# EAGLE design STM32L441CE_2L (EAGLE 9.6.2)

## Sheet 1 of 2
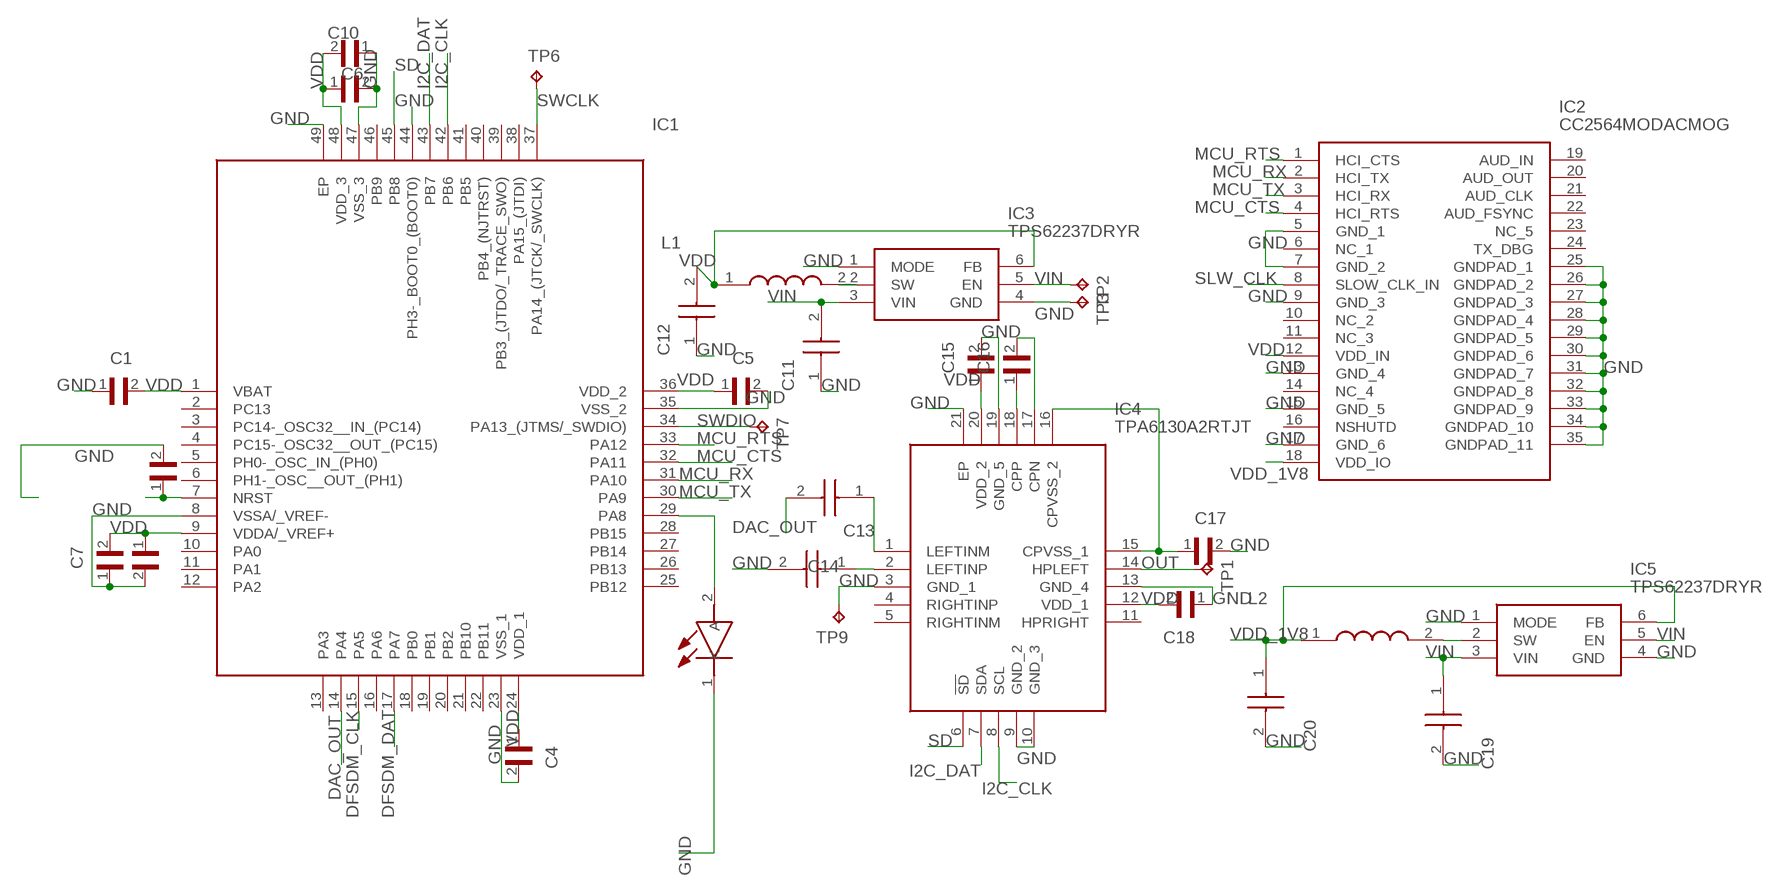
[diagram p0: schematic, sheet 1]

### Parts
C1  GRM033C80J104KE15D  [CAPC0603X33N]
C2  GRM033C80J104KE15D  [CAPC0603X33N]
C3  GRM033C80J104KE15D  [CAPC0603X33N]
C4  GRM033C80J104KE15D  [CAPC0603X33N]
C5  GRM033C80J104KE15D  [CAPC0603X33N]
C6  GRM033C80J104KE15D  [CAPC0603X33N]
C7  JMK105C6105KV-F  [CAPC1005X55N]
C10  GRM155R60J475ME47D  [CAPC1005X60N]
C11  02016D225MAT2A  [CAPC0603X33N]
C12  GRM035R60J475ME15D  [CAPC0603X55N]
C13  CL03A474KQ3NNNC  [CAPC0603X33N]
C14  CL03A474KQ3NNNC  [CAPC0603X33N]
C15  JMK105C6105KV-F  [CAPC1005X55N]
C16  JMK105C6105KV-F  [CAPC1005X55N]
C17  JMK105C6105KV-F  [CAPC1005X55N]
C18  JMK105C6105KV-F  [CAPC1005X55N]
C19  02016D225MAT2A  [CAPC0603X33N]
C20  GRM035R60J475ME15D  [CAPC0603X55N]
IC1  STM32L451CEU6  [QFN50P700X700X60-49N]
IC2  CC2564MODACMOG  [MOG0035A]
IC3  TPS62237DRYR  [SON50P100X145X60-6N]
IC4  TPA6130A2RTJT  [QFN50P400X400X80-21N]
IC5  TPS62237DRYR  [SON50P100X145X60-6N]
L1  MLZ1005M2R2WT000  [INDC1005X55N]
L2  MLZ1005M2R2WT000  [INDC1005X55N]
LED1  VLMS1500-GS08  [VLMG1500GS08]
TP1  TPTP11R  [TP11R]
TP2  TPTP11R  [TP11R]
TP3  TPTP11R  [TP11R]
TP6  TPTP11R  [TP11R]
TP7  TPTP11R  [TP11R]
TP9  TPTP11R  [TP11R]

### Nets
DAC_OUT: C13.2 IC1.14(PA4)
DFSDM_CLK: IC1.15(PA5) ; also sheet 2
DFSDM_DAT: IC1.17(PA7) ; also sheet 2
GND: C1.1 C2.2 C3.2 C4.2 C5.2 C6.2 C7.1 C10.1 C11.1 C12.1 C14.2 C15.2 C17.2 C18.1 C19.2 C20.2 IC1.8(VSSA/_VREF-) IC1.23(VSS_1) IC1.35(VSS_2) IC1.44(PH3-_BOOT0_(BOOT0)) IC1.47(VSS_3) IC1.49(EP) IC2.5(GND_1) IC2.7(GND_2) IC2.9(GND_3) IC2.13(GND_4) IC2.15(GND_5) IC2.17(GND_6) IC2.25(GNDPAD_1) IC2.26(GNDPAD_2) IC2.27(GNDPAD_3) IC2.28(GNDPAD_4) IC2.29(GNDPAD_5) IC2.30(GNDPAD_6) IC2.31(GNDPAD_7) IC2.32(GNDPAD_8) IC2.33(GNDPAD_9) IC2.34(GNDPAD_10) IC2.35(GNDPAD_11) IC3.1(MODE) IC3.4(GND) IC4.3(GND_1) IC4.9(GND_2) IC4.10(GND_3) IC4.13(GND_4) IC4.19(GND_5) IC4.21(EP) IC5.1(MODE) IC5.4(GND) LED1.1(K) TP3.TP TP9.TP ; also sheet 2
I2C_CLK: IC1.42(PB6) IC4.8(SCL)
I2C_DAT: IC1.43(PB7) IC4.7(SDA)
MCU_CTS: IC1.32(PA11) IC2.4(HCI_RTS)
MCU_RTS: IC1.33(PA12) IC2.1(HCI_CTS)
MCU_RX: IC1.31(PA10) IC2.2(HCI_TX)
MCU_TX: IC1.30(PA9) IC2.3(HCI_RX)
N$1: C2.1 IC1.7(NRST)
N$2: IC3.2(SW) L1.2
N$3: C13.1 IC4.1(LEFTINM)
N$4: C14.1 IC4.2(LEFTINP)
N$5: IC1.29(PA8) LED1.2(A)
N$6: C16.1 IC4.18(CPP)
N$7: C16.2 IC4.17(CPN)
N$8: C17.1 IC4.15(CPVSS_1) IC4.16(CPVSS_2)
N$9: IC5.2(SW) L2.2
OUT: IC4.14(HPLEFT) TP1.TP
SD: IC1.45(PB8) IC4.6(!SD)
SLW_CLK: IC2.8(SLOW_CLK_IN)
SWCLK: IC1.37(PA14_(JTCK/_SWCLK)) TP6.TP
SWDIO: IC1.34(PA13_(JTMS/_SWDIO)) TP7.TP
VDD: C1.2 C3.1 C4.1 C5.1 C6.1 C7.2 C10.2 C12.2 C15.1 C18.2 IC1.1(VBAT) IC1.9(VDDA/_VREF+) IC1.24(VDD_1) IC1.36(VDD_2) IC1.48(VDD_3) IC2.12(VDD_IN) IC3.6(FB) IC4.12(VDD_1) IC4.20(VDD_2) L1.1 ; also sheet 2
VDD_1V8: C20.1 IC2.18(VDD_IO) IC5.6(FB) L2.1
VIN: C11.2 C19.1 IC3.3(VIN) IC3.5(EN) IC5.3(VIN) IC5.5(EN) TP2.TP
Unconnected: IC1.2(PC13) IC1.3(PC14-_OSC32__IN_(PC14)) IC1.4(PC15-_OSC32__OUT_(PC15)) IC1.5(PH0-_OSC_IN_(PH0)) IC1.6(PH1-_OSC__OUT_(PH1)) IC1.10(PA0) IC1.11(PA1) IC1.12(PA2) IC1.13(PA3) IC1.16(PA6) IC1.18(PB0) IC1.19(PB1) IC1.20(PB2) IC1.21(PB10) IC1.22(PB11) IC1.25(PB12) IC1.26(PB13) IC1.27(PB14) IC1.28(PB15) IC1.38(PA15_(JTDI)) IC1.39(PB3_(JTDO/_TRACE_SWO)) IC1.40(PB4_(NJTRST)) IC1.41(PB5) IC1.46(PB9) IC2.6(NC_1) IC2.10(NC_2) IC2.11(NC_3) IC2.14(NC_4) IC2.16(NSHUTD) IC2.19(AUD_IN) IC2.20(AUD_OUT) IC2.21(AUD_CLK) IC2.22(AUD_FSYNC) IC2.23(NC_5) IC2.24(TX_DBG) IC4.4(RIGHTINP) IC4.5(RIGHTINM) IC4.11(HPRIGHT)

## Sheet 2 of 2
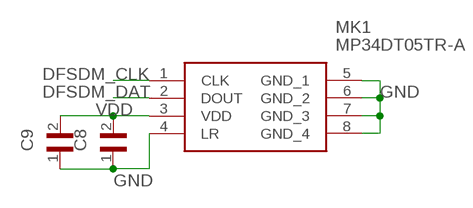
[diagram p1: schematic, sheet 2]

### Parts
C8  JMK105C6105KV-F  [CAPC1005X55N]
C9  GRM033C80J104KE15D  [CAPC0603X33N]
MK1  MP34DT05TR-A  [MP34DT05TRA]

### Nets
DFSDM_CLK: MK1.1(CLK) ; also sheet 1
DFSDM_DAT: MK1.2(DOUT) ; also sheet 1
GND: C8.1 C9.1 MK1.4(LR) MK1.5(GND_1) MK1.6(GND_2) MK1.7(GND_3) MK1.8(GND_4) ; also sheet 1
VDD: C8.2 C9.2 MK1.3(VDD) ; also sheet 1

## Library data of the parts
C1-C6 C9 = GRM033C80J104KE15D:GRM033C80J104KE15D: .1UF 6.3V 10% 0201; DESCRIPTION: SMD Capacitor X6S(EIA) with Capacitance: 0.10uF Tol. 10%. Rated Voltage: 6.3Vdc; DIGI-KEY_PART_NUMBER: 490-10390-1-ND; DIGIKEY-PURCHASE-URL: https://snapeda.com/shop?store=DigiKey&id=1836969; MF: Murata Electronics; MP: GRM033C80J104KE15D; PACKAGE: 0603 Taiyo Yuden
C7 C8 C15-C18 = JMK105C6105KV-F:JMK105C6105KV-F: CAP CER 1UF 6.3V X6S 0402; DESCRIPTION: 1µF ±10% 6.3V Ceramic Capacitor X6S 0402 (1005 Metric); DIGI-KEY_PART_NUMBER: 587-3381-1-ND; MF: Taiyo Yuden; MP: JMK105C6105KV-F; PACKAGE: 1005 Taiyo Yuden
C10 = GRM155R60J475ME47D:GRM155R60J475ME47D: Cap Ceramic 4.7uF 6.3V X5R 20% Pad SMD 0402 85°C T/R; DESCRIPTION: SMD Capacitor X5R(EIA) with Capacitance: 4.7uF Tol. 20%. Rated Voltage: 6.3Vdc; DIGI-KEY_PART_NUMBER: 490-5915-1-ND; MF: Murata; MP: GRM155R60J475ME47D; PACKAGE: 1005 Taiyo Yuden
C11 C19 = 02016D225MAT2A:02016D225MAT2A: Multilayer Ceramic Capacitors MLCC - SMD/SMT 6.3V 2.2uF X5R 0201 20% Tol Source: Datasheet <http://www.mouser.com/catalog/supplier/library/pdf/AVXSurfaceMountCeramic.pdf>; ARROW_PART_NUMBER: 02016D225MAT2A; ARROW_PRICE-STOCK: https://www.arrow.com/en/products/02016d225mat2a/avx; DESCRIPTION: Multilayer Ceramic Capacitors MLCC - SMD/SMT 6.3V 2.2uF X5R 0201 20% Tol; HEIGHT: 0.33mm; MANUFACTURER_NAME: AVX; MANUFACTURER_PART_NUMBER: 02016D225MAT2A; MOUSER_PART_NUMBER: 581-02016D225MAT2A; MOUSER_PRICE-STOCK: https://www.mouser.co.uk/ProductDetail/AVX/02016D225MAT2A?qs=ZBeOGGPQgEHFnviVlXcPQQ%3D%3D
C12 C20 = GRM035R60J475ME15D:GRM035R60J475ME15D: Multilayer Ceramic Capacitors MLCC - SMD/SMT 0201 4.7uF 6.3volts *Derate Voltage/Temp Source: Datasheet <https://psearch.en.murata.com/capacitor/product/GRM035R60J475ME15#.pdf>; ARROW_PART_NUMBER: GRM035R60J475ME15D; ARROW_PRICE-STOCK: https://www.arrow.com/en/products/grm035r60j475me15d/murata-manufacturing; DESCRIPTION: Multilayer Ceramic Capacitors MLCC - SMD/SMT 0201 4.7uF 6.3volts *Derate Voltage/Temp; HEIGHT: 0.55mm; MANUFACTURER_NAME: Murata Electronics; MANUFACTURER_PART_NUMBER: GRM035R60J475ME15D; MOUSER_PART_NUMBER: 81-GRM035R60J475ME5D; MOUSER_PRICE-STOCK: https://www.mouser.co.uk/ProductDetail/Murata-Electronics/GRM035R60J475ME15D?qs=I53XXhTNm8vhFCgPvCZ%252BPQ%3D%3D
C13 C14 = CL03A474KQ3NNNC:CL03A474KQ3NNNC: CAP CER 0.47UF 6.3V X5R 0201 Source: Datasheet <https://static6.arrow.com/aropdfconversion/f331fa34aa05e23db43dec65c064e91f2185871/19-cl03a474kq3nnnc.pdf>; DESCRIPTION: CAP CER 0.47UF 6.3V X5R 0201; HEIGHT: 0.33mm; MANUFACTURER_NAME: Samsung Electro-Mechanics; MANUFACTURER_PART_NUMBER: CL03A474KQ3NNNC
IC1 = STM32L451CEU6:STM32L451CEU6: MCU 32-bit ARM Cortex M4 RISC 512KB Flash 3.3V 48-Pin UFQFPN Tray Source: Datasheet <https://www.arrow.com/en/products/stm32l451ceu6/stmicroelectronics>; ARROW_PART_NUMBER: STM32L451CEU6; ARROW_PRICE-STOCK: https://www.arrow.com/en/products/stm32l451ceu6/stmicroelectronics; DESCRIPTION: MCU 32-bit ARM Cortex M4 RISC 512KB Flash 3.3V 48-Pin UFQFPN Tray; HEIGHT: 0.6mm; MANUFACTURER_NAME: STMicroelectronics; MANUFACTURER_PART_NUMBER: STM32L451CEU6; MOUSER_PART_NUMBER: 511-STM32L451CEU6; MOUSER_PRICE-STOCK: https://www.mouser.com/Search/Refine.aspx?Keyword=511-STM32L451CEU6
IC2 = CC2564MODACMOG:CC2564MODACMOG: Dual-mode Bluetooth® CC2564 module with integrated antenna Source: Datasheet <http://www.ti.com/lit/ds/symlink/cc2564moda.pdf>; ARROW_PART_NUMBER: CC2564MODACMOG; ARROW_PRICE-STOCK: https://www.arrow.com/en/products/cc2564modacmog/texas-instruments; DESCRIPTION: Dual-mode Bluetooth&#174; CC2564 module with integrated antenna; HEIGHT: mm; MANUFACTURER_NAME: Texas Instruments; MANUFACTURER_PART_NUMBER: CC2564MODACMOG; MOUSER_PART_NUMBER: 595-CC2564MODACMOG; MOUSER_PRICE-STOCK: https://www.mouser.co.uk/ProductDetail/Texas-Instruments/CC2564MODACMOG?qs=tCMd4XlZ%2FiD0qx2OJWZ%2FcQ%3D%3D
IC3 IC5 = TPS62237DRYR:TPS62237DRYR: 2 MHz Ultra Small Step Down Converter with DCS-Control in 1x1.5 SON Package Source: Datasheet <http://www.ti.com/lit/gpn/TPS62230>; ARROW_PART_NUMBER: TPS62237DRYR; ARROW_PRICE-STOCK: https://www.arrow.com/en/products/tps62237dryr/texas-instruments; DESCRIPTION: 2 MHz Ultra Small Step Down Converter with DCS-Control in 1x1.5 SON Package; HEIGHT: 0.6mm; MANUFACTURER_NAME: Texas Instruments; MANUFACTURER_PART_NUMBER: TPS62237DRYR; MOUSER_PART_NUMBER: 595-TPS62237DRYR; MOUSER_PRICE-STOCK: https://www.mouser.co.uk/ProductDetail/Texas-Instruments/TPS62237DRYR?qs=%2Fqzd9s%252BcLd6Amw0z%252Byi3sQ%3D%3D
IC4 = TPA6130A2RTJT:TPA6130A2RTJT: Texas Instruments TPA6130A2RTJT Headphone Audio Amplifier, Class-AB Mono/Stereo 68dB, 20-Pin QFN Source: Datasheet <http://www.ti.com/lit/ds/symlink/tpa6130a2.pdf>; ARROW_PART_NUMBER: TPA6130A2RTJT; ARROW_PRICE-STOCK: https://www.arrow.com/en/products/tpa6130a2rtjt/texas-instruments; DESCRIPTION: Texas Instruments TPA6130A2RTJT Headphone Audio Amplifier, Class-AB Mono/Stereo 68dB, 20-Pin QFN; HEIGHT: 0.8mm; MANUFACTURER_NAME: Texas Instruments; MANUFACTURER_PART_NUMBER: TPA6130A2RTJT; MOUSER_PART_NUMBER: 595-TPA6130A2RTJT; MOUSER_PRICE-STOCK: https://www.mouser.co.uk/ProductDetail/Texas-Instruments/TPA6130A2RTJT?qs=7kv20MEVUlhbnsEmMhzkWg%3D%3D
L1 L2 = MLZ1005M2R2WT000:MLZ1005M2R2WT000: Inductor Power Shielded Multi-Layer 2.2uH 20% 2MHz Ferrite 350mA 715mOhm DCR 0402 T/R Source: Datasheet <https://product.tdk.com/info/en/catalog/datasheets/inductor_commercial_decoupling_mlz1005_en.pdf>; ARROW_PART_NUMBER: MLZ1005M2R2WT000; ARROW_PRICE-STOCK: https://www.arrow.com/en/products/mlz1005m2r2wt000/tdk; DESCRIPTION: Inductor Power Shielded Multi-Layer 2.2uH 20% 2MHz Ferrite 350mA 715mOhm DCR 0402 T/R; HEIGHT: 0.55mm; MANUFACTURER_NAME: TDK; MANUFACTURER_PART_NUMBER: MLZ1005M2R2WT000; MOUSER_PART_NUMBER: 810-MLZ1005M2R2WT000; MOUSER_PRICE-STOCK: https://www.mouser.co.uk/ProductDetail/TDK/MLZ1005M2R2WT000?qs=%2FPzWLGNeQ%252BiWY3SLL2a3ow%3D%3D
LED1 = VLMS1500-GS08:VLMS1500-GS08: Vishay 631 nm Red LED, 1005 (0402) SMD package Source: Datasheet <https://componentsearchengine.com/Datasheets/2/VLMS1500-GS08.pdf>; ARROW_PART_NUMBER: VLMS1500-GS08; ARROW_PRICE-STOCK: https://www.arrow.com/en/products/vlms1500-gs08/vishay; DESCRIPTION: Vishay 631 nm Red LED, 1005 (0402) SMD package; HEIGHT: mm; MANUFACTURER_NAME: Vishay; MANUFACTURER_PART_NUMBER: VLMS1500-GS08; MOUSER_PART_NUMBER: 78-VLMS1500-GS08; MOUSER_PRICE-STOCK: https://www.mouser.co.uk/ProductDetail/Vishay-Semiconductors/VLMS1500-GS08?qs=2BArZ0I3QllOybMBfd%252BobQ%3D%3D
MK1 = MP34DT05TR-A:MP34DT05TR-A: STMICROELECTRONICS - MP34DT05TR-A - MEMS MICROPHONE, 3.6V, HCLGA-4 Source: Datasheet <http://www.st.com/content/ccc/resource/technical/document/datasheet/group3/c7/90/d3/f6/b7/e7/40/c8/DM00415595/files/DM00415595.pdf/jcr:content/translations/en.DM00415595.pdf>; DESCRIPTION: STMICROELECTRONICS - MP34DT05TR-A - MEMS MICROPHONE, 3.6V, HCLGA-4; HEIGHT: 1mm; MANUFACTURER_NAME: STMicroelectronics; MANUFACTURER_PART_NUMBER: MP34DT05TR-A; MOUSER_PART_NUMBER: 511-MP34DT05TR-A; MOUSER_PRICE-STOCK: https://www.mouser.com/Search/Refine.aspx?Keyword=511-MP34DT05TR-A
TP1-TP3 TP6 TP7 TP9 = testpad:TP: Test pad

## Board
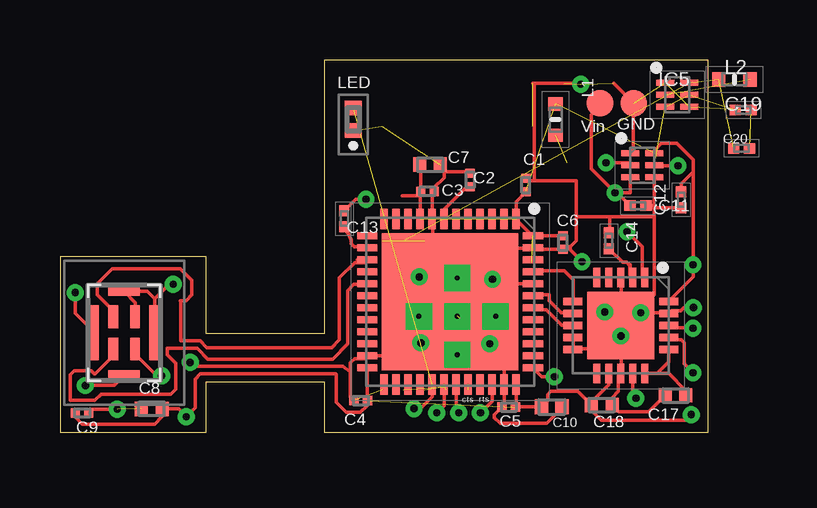
[diagram p2: board, top side]
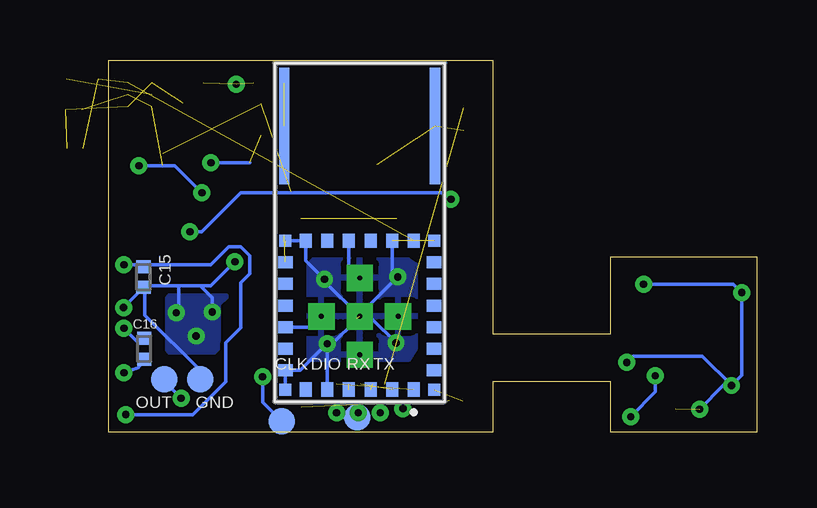
[diagram p3: board, bottom side, seen from below]

Size 27 x 15.5 mm. Coordinates in mm from the lower left corner, seen from the top.
Outline: 0,0 6.1,0 6.1,2.1 11,2.1 11,0 27,0 27,15.5 11,15.5 11,4.1 6.1,4.1 6.1,7.31 0,7.31 0,0
Copper layers (1*16): Top 0.035mm / dielectric 1.5mm / Bottom 0.035mm
Design rules "default *": minimum track width 6mil, minimum drill 0.3mm, track to track 6mil, track to pad 6mil, pad to pad 6mil, via to via 6mil, smd to smd 6mil, copper to edge 10mil, drill to drill 0.3mm, minimum pad ring 10mil, minimum via ring 8mil, stop-mask expansion 4mil, vias tented up to drill 0mil, thermal gap 10mil

### Footprints (pad centres in the part's own frame; a part is rotated, then mirrored left to right if it is on the bottom)
CAPC0603X33N = smd 0.38 x 0.4: 1 -0.281,0; 2 0.281,0
CAPC1005X55N = smd 0.54 x 0.6: 1 -0.432,0; 2 0.432,0
CAPC1005X60N = smd 0.56 x 0.63: 1 -0.435,0; 2 0.435,0
CAPC0603X33N' = smd 0.47 x 0.44: 1 -0.335,0; 2 0.335,0
CAPC0603X55N = smd 0.465 x 0.44: 1 -0.332,0; 2 0.332,0
CAPC0603X33N'' = smd 0.46 x 0.42: 1 -0.33,0; 2 0.33,0
QFN50P700X700X60-49N = smd 0.85 x 0.3: 1 -3.45,2.75; 2 -3.45,2.25; 3 -3.45,1.75; 4 -3.45,1.25; 5 -3.45,0.75; 6 -3.45,0.25; 7 -3.45,-0.25; 8 -3.45,-0.75; 9 -3.45,-1.25; 10 -3.45,-1.75; 11 -3.45,-2.25; 12 -3.45,-2.75; 25 3.45,-2.75; 26 3.45,-2.25; 27 3.45,-1.75; 28 3.45,-1.25; 29 3.45,-0.75; 30 3.45,-0.25; 31 3.45,0.25; 32 3.45,0.75; 33 3.45,1.25; 34 3.45,1.75; 35 3.45,2.25; 36 3.45,2.75 | smd 0.3 x 0.85: 13 -2.75,-3.45; 14 -2.25,-3.45; 15 -1.75,-3.45; 16 -1.25,-3.45; 17 -0.75,-3.45; 18 -0.25,-3.45; 19 0.25,-3.45; 20 0.75,-3.45; 21 1.25,-3.45; 22 1.75,-3.45; 23 2.25,-3.45; 24 2.75,-3.45; 37 2.75,3.45; 38 2.25,3.45; 39 1.75,3.45; 40 1.25,3.45; 41 0.75,3.45; 42 0.25,3.45; 43 -0.25,3.45; 44 -0.75,3.45; 45 -1.25,3.45; 46 -1.75,3.45; 47 -2.25,3.45; 48 -2.75,3.45 | smd 5.7 x 5.7: 49 0,0
MOG0035A = smd 0.6 x 0.5: 1 -6.55,-2.25; 2 -6.55,-1.35; 3 -6.55,-0.45; 4 -6.55,0.45; 5 -6.55,1.35; 6 -6.55,2.25; 13 -0.35,2.25; 14 -0.35,1.35; 15 -0.35,0.45; 16 -0.35,-0.45; 17 -0.35,-1.35; 18 -0.35,-2.25 | smd 0.5 x 0.6: 7 -5.75,3.1; 8 -4.85,3.1; 9 -3.95,3.1; 10 -3.05,3.1; 11 -2.15,3.1; 12 -1.25,3.1; 19 -1.25,-3.1; 20 -2.15,-3.1; 21 -3.05,-3.1; 22 -3.95,-3.1; 23 -4.85,-3.1; 24 -5.75,-3.1 | drill 0.2 pad 1.1 square: 25 -5.1,0; 26 -3.5,1.6; 27 -3.5,0; 28 -3.5,-1.6; 29 -1.9,0 | smd 0.5 x 0.5: 30 -6.55,-3.1; 31 -6.55,3.1; 32 -0.35,3.1; 33 -0.35,-3.1 | smd 4.85 x 0.43: 34 4.425,-3.135; 35 4.425,3.15
SON50P100X145X60-6N = smd 0.75 x 0.25: 1 -0.5,0.5; 2 -0.5,0; 3 -0.5,-0.5; 4 0.5,-0.5; 5 0.5,0; 6 0.5,0.5
QFN50P400X400X80-21N = smd 0.8 x 0.3: 1 -2,1; 2 -2,0.5; 3 -2,0; 4 -2,-0.5; 5 -2,-1; 11 2,-1; 12 2,-0.5; 13 2,0; 14 2,0.5; 15 2,1 | smd 0.3 x 0.8: 6 -1,-2; 7 -0.5,-2; 8 0,-2; 9 0.5,-2; 10 1,-2; 16 1,2; 17 0.5,2; 18 0,2; 19 -0.5,2; 20 -1,2 | smd 2.8 x 2.8: 21 0,0
INDC1005X55N = smd 0.55 x 0.6: 1 -0.65,0; 2 0.65,0
VLMG1500GS08 = smd 0.6 x 0.7: 1 -0.475,0; 2 0.475,0
MP34DT05TRA = smd 0.4 x 0.95: 1 -0.45,0.675; 2 -0.45,-0.675; 3 0.45,-0.675; 4 0.45,0.675 | smd 0.35 x 2.3: 5 -1.225,0; 6 1.225,0 | smd 1.3 x 0.35: 7 0,1.725; 8 0,-1.725
TP11R = smd 1.1 x 1.1: TP 0,0

### Placement (x,y rotation side)
C1  19.41,10.29 270 top
C2  17.08,10.5 90 top
C3  15.31,10.02 0 top
C4  12.53,1.31 180 top
C5  18.7,1.04 180 top
C6  20.96,7.89 270 top
C7  15.42,11.14 180 top
C8  3.82,0.96 0 top
C9  0.92,0.8 180 top
C10  20.49,1.05 180 top
C11  02016D225MAT2A  [CAPC0603X33N']  24.09,9.43 180 top
C12  25.88,9.68 90 top
C13  CL03A474KQ3NNNC  [CAPC0603X33N'']  11.85,8.89 270 top
C14  CL03A474KQ3NNNC  [CAPC0603X33N'']  22.87,7.97 90 top
C15  25.56,6.46 270 bottom
C16  25.53,3.47 270 bottom
C17  25.65,1.53 180 top
C18  22.57,1.13 180 top
C19  02016D225MAT2A  [CAPC0603X33N']  28.47,13.42 0 top
C20  28.4,11.82 0 top
IC1  16.25,5.43 270 top
IC2  16.55,8.32 90 bottom
IC3  24.25,11.11 0 top
IC4  23.37,4.44 270 top
IC5  25.71,14.05 0 top
L1  20.65,13.02 270 top
L2  28.1,14.69 0 top
LED1  12.22,13.03 90 top
MK1  2.67,4.13 0 top
TP1  24.7,2.2 0 bottom
TP2  22.5,13.7 0 top
TP3  23.2,2.2 0 bottom
TP6  19.8,0.45 0 bottom
TP7  16.66,0.62 0 bottom
TP9  23.9,13.7 0 top

### Tracks (layer width: path | path; a pad name or v marks a point on that pad's centre or on a via)
DAC_OUT
  Top 0.152: C13.2 12.12,8.02 12.12,7.85 12.25,7.72 12.75,7.72 IC1.14
DFSDM_CLK
  Top 0.152: MK1.1 2.22,5.05 1.56,5.71 1.56,6.18 2.18,6.8 5.01,6.8 5.49,6.31 5.49,5.71 5.25,5.47 5.02,5.47 5.03,5.46 5.03,3.79 5.84,3.79 6.12,3.51 11.32,3.51 11.64,3.83 11.64,6.42 12.28,7.06 12.68,7.06 IC1.15 | IC1.15 | 12.39,7.17 12.79,7.17 IC1.15
DFSDM_DAT
  Top 0.152: IC1.17 12.78,6.15 12.24,6.15 11.99,5.89 11.99,3.67 11.36,3.04 6.16,3.04 5.71,3.49 4.47,3.49 4.47,3.22 4.82,2.87 4.82,1.79 4.61,1.58 1.71,1.58 1.45,1.32 0.43,1.32 0.43,2.38 0.59,2.54 1.31,2.54 1.43,2.43 1.47,2.43 2.22,3.17 MK1.2
GND  (via drill 0.3)  (14 unrouted)
  Top 0.152: C10.1 20.93,1 20.28,0.36 18.34,0.36 18.1,0.6 18.1,0.72 C5.2 18.5,1.12 IC1.35 18.5,3.18 IC1.49 | IC3.4 24.75,9.45 | 16,10.85 16,10.6 15.59,10.19 C3.2 15.5,9.93 IC1.8 15.52,8.86 15.52,8.16 16.77,6.91 18.02,6.91 | 16,10.85 16,10.99 C7.1 16,10.85 | IC1.44 17,6.18 | 18.01,6.99 18.68,7.66 19.68,7.66 IC1.47 19.77,7.61 C6.2 21,7.72 21.25,7.72 | 18.02,6.91 18.37,6.91 18.37,7.82 16.25,5.7 | 16.25,5.7 13.73,3.18 IC1.23 12.68,3.06 12.28,3.06 12.1,2.88 12.1,1.46 | 12.1,1.46 C4.2 12.1,1.46 | 3.46,1.02 C8.1 | 21.38,3.48 21.38,3.85 IC4.9 | C17.2 24.54,0.85 23.28,0.85 C18.1 23,1.43 23.27,1.7 23.27,2.34 IC4.13 23.38,2.48 23.38,3.48 | 23.38,4.97 23.38,4.47 IC4.21 | 23.38,4.97 23.38,6.35 IC4.3 | 23.38,4.97 v24.2,4.97 | v24.2,4.97 24.62,4.97 | 24.62,4.97 25.25,4.97 IC4.19 25.49,5.06 25.86,5.06 25.99,5.18 v26.39,5.18 | 23.38,4.97 IC4.21 | 23.38,3.48 23.38,4.35 IC4.21 | 23.38,3.48 21.38,3.48 | 21.38,3.48 IC4.10 | 23.38,3.48 v23.37,4 IC4.21 | 24.75,8.97 24.75,5.72 24.62,5.6 24.62,4.97 | 24.75,8.97 24.75,9.45 | 24.62,4.97 IC4.21 | IC3.1 23.75,11.72 23.88,11.85 23.88,13.6 TP9.TP 23.07,14.53 | 16,10.85 17,10.85 C2.2 | 19.75,10.47 21.5,10.47 21.5,8.97 | 19.75,10.47 19.5,10.47 C1.1 | 21.5,8.97 21.5,7.97 21.25,7.72 | 12.1,1.46 12.1,2.52 11.77,2.73 5.58,2.73 v5.42,2.9 | 19.69,14.53 21.7,14.53 v21.7,14.49 | 20.99,14.53 19.75,14.53 19.75,10.47 | v21.75,7.1 21.25,7.6 21.25,7.72 | 21.5,8.97 22.9,8.97 | 22.9,8.97 24.75,8.97 | 17,6.18 17.73,6.91 | IC1.49 16.25,5.15 | IC1.49 16.15,5.43 14.78,6.8 | IC4.21 23.91,4.97 v24.2,4.97 | IC4.21 22.81,5 v22.7,5 | IC1.49 16.25,5.7 | IC1.49 17,6.18 | v18.02,6.36 18.02,6.91 | 22.9,8.97 22.9,8.33 C14.2 | C11.1 24.44,9.45 24.47,9.45
  Top 0.152: 24.47,9.45 24.75,9.45 | C12.1 24.58,9.35 24.47,9.45 | 3.94,5.17 3.9,5.21 MK1.6 3.95,4.18 3.95,5.54 | 3.95,5.54 3.64,5.86 MK1.7 3.13,5.39 3.13,4.82 MK1.4 | 3.95,5.54 4.56,6.16 v4.72,6.16 | v0.63,5.81 0.63,4.94 MK1.5 | MK1.8 2.67,2.35 2.26,1.94 v1.06,1.94 | C9.1 1.34,0.94 v2.39,0.94
  Bottom 0.152: TP3.TP 23.2,2.58 25.5,4.88 25.5,5.97 C15.2 | 23.2,6.1 22.75,6.1 v21.75,7.1 | 23.2,6.1 24.1,6.1 | 24.1,6.1 25.5,6.1 C15.2 | v26.39,5.18 26.39,5.2 C15.2 | v24.2,4.97 24.1,5.08 24.1,6.1 | v22.7,5 22.7,5.6 23.2,6.1 | 16.68,4.75 16.68,4.65 | v4.72,6.16 0.98,6.16 v0.63,5.81 0.63,2.37 v1.06,1.94 | v2.39,0.94 1.4,1.94 v1.06,1.94 | v5.42,2.9 5.16,3.16 2.28,3.16 v1.06,1.94 | IC2.9 18.6,4.37 IC2.26 | 18.05,3.54 19.02,2.57 IC2.7 IC2.31 | 18.05,3.54 v17.91,3.68 17.69,3.68 16.68,4.68 | IC2.5 17.9,3.4 18.05,3.54 | IC2.17 15.2,6.69 v14.97,6.46 16.55,4.88 IC2.27 | IC2.15 17,6.87 IC2.29 | IC2.32 IC2.13 18.8,7.14 v18.02,6.36 18.02,6.29 IC2.27 | 16.68,4.68 IC2.27 | IC2.27 16.15,4.82 v15.04,3.71 16.02,4.68 16.68,4.68
  pour Bottom: 22.1,5.7 24.5,5.7 24.6,5.6 24.6,3.4 24.5,3.3 22.6,3.3 22.4,3.5 22.4,5.3 22.1,5.6
  pour Bottom: 14.5,7.2 18.5,7.2 18.7,7 18.7,3 14.5,3 14.2,3.5 14.2,7
I2C_CLK
  Top 0.152: IC4.8 20.91,4.44 20.25,5.1 19.75,5.1 IC1.42
I2C_DAT
  Top 0.152: IC1.43 19.75,5.72 20.38,5.72 20.38,5.47 20.88,4.97 21.25,4.97 IC4.7
MCU_CTS  (1 unrouted)
MCU_RTS  (1 unrouted)
MCU_RX  (via drill 0.3)  (1 unrouted)
  Top 0.152: 16.6,1.88 IC1.31 16.5,0.91 v16.61,0.8
MCU_TX  (via drill 0.3)  (1 unrouted)
  Top 0.152: IC1.30 16,1.1 v15.7,0.8
N$1
  Top 0.152: IC1.7 16,9.28 16.94,10.22 C2.1 17.12,10.22
N$2  (via drill 0.3)  (1 unrouted)
  Top 0.152: v22.75,11.22 23.75,11.22 IC3.2
  Bottom 0.152: 21.12,11.22 v22.75,11.22
N$3  (via drill 0.3)
  Top 0.152: v23.62,8.35 24.25,7.72 24.25,6.47 IC4.1 | v12.75,9.7 12.32,9.7 C13.1
  Bottom 0.152: v12.75,9.7 13.02,9.96 21.51,9.96 23.12,8.35 v23.62,8.35
N$4
  Top 0.152: 23.75,6.97 23.75,6.47 IC4.2 23.75,6.56 23.75,6.93 23.61,7.07 23.44,7.07 C14.1
N$5  (via drill 0.3)  (1 unrouted)
  Top 0.152: v14.75,0.97 15,0.97 15.5,1.48 IC1.29
N$6  (via drill 0.3)
  Top 0.152: v26.38,4.33 26.35,4.35 25.38,4.35 IC4.18
  Bottom 0.152: v26.38,4.33 25.79,3.74 C16.1
N$7  (via drill 0.3)
  Top 0.152: v26.38,2.48 26,2.85 26,3.73 25.88,3.85 25.38,3.85 IC4.17
  Bottom 0.152: v26.38,2.48 25.79,2.68 C16.2
N$8
  Top 0.152: IC4.16 25.37,2.9 25.35,2.9 24.89,2.44 IC4.15 25.37,2.44 26.08,1.73 C17.1
N$9  (1 unrouted)
OUT  (via drill 0.3)
  Top 0.152: IC4.14 23.87,1.53 v24,1.4
  Bottom 0.152: TP1.TP 24.7,2.11 v24,1.4
SD
  Top 0.152: IC4.6 21.38,5.47 21.38,6.35 21,6.72 19.75,6.72 IC1.45
SWCLK  (via drill 0.3)
  Top 0.152: IC1.37 20.08,2.3 v20.6,2.3
  Bottom 0.152: v20.6,2.3 20.6,1.25 TP6.TP
SWDIO  (via drill 0.3)
  Top 0.152: IC1.34 18,1.28 v17.52,0.8
  Bottom 0.152: v17.52,0.8 17.34,0.62 TP7.TP
VDD  (via drill 0.3)  (5 unrouted)
  Top 0.152: IC1.36 19,1.06 | 19,1.06 C5.1 | 19,1.06 C10.2 20.32,1.31 20.32,1.56 20.45,1.69 21.57,1.69 C18.2 | IC4.12 22.87,1.97 22.14,1.24 C18.2 | IC1.9 15,9.85 | 15,9.85 15,9.99 C3.1 | C3.1 15.03,11.1 C7.2 14.88,11.22 | C6.1 IC1.48 19.62,8.22 19,8.85 IC1.1 19,9.6 C1.2 19.25,9.85 | IC1.24 C4.1 12.81,1.08 12.51,0.82 11.92,0.82 11.5,1.24 11.5,2.41 11.48,2.43 5.85,2.43 5.63,2.21 5.63,1.01 v5.26,0.64 4.94,0.96 C8.2 | C8.2 | IC3.6 24.75,11.72 25.05,12.02 25.7,12.02 26.38,11.35 26.38,10.84 | 26.38,10.84 v26.38,6.97 26.38,6.47 25.38,5.47 IC4.20 | C18.2 22.14,0.91 22.55,0.5 26.3,0.5 v26.3,0.72 | 14.25,9.85 15,9.85 | 15,9.85 C3.1 | C12.2 25.88,10.35 26.38,10.84 | MK1.3 3.12,3.26 4.04,2.34 v4.23,2.34 | C9.2 0.64,0.63 0.94,0.33 3.94,0.33 4.24,0.62 4.24,0.94 C8.2
  Bottom 0.152: v26.3,0.72 23.5,0.72 22.12,2.1 22.12,3.73 21.5,4.35 21.5,6.22 21.12,6.6 21.12,7.35 21.5,7.72 22,7.72 22.75,6.97 25.5,6.97 C15.1 25.62,6.97 v26.38,6.97 | v5.26,0.64 4.23,1.67 v4.23,2.34
VDD_1V8  (3 unrouted)
VIN  (via drill 0.3)  (3 unrouted)
  Top 0.152: IC3.3 23.75,9.97 v23.12,9.97 23.05,10.04 | v25.75,11.1 IC3.5 | 23.05,10.04 22.12,10.97 22.12,13.22 22.5,13.6 TP2.TP | C11.2 23.14,10.04 23.05,10.04
  Bottom 0.152: v25.75,11.1 24.25,11.1 v23.12,9.97

### Text on the board
tNames: LED | GND | Vin | cts | rts
bNames: TX | RX | DIO | CLK | GND | OUT